# EAGLE design gtjennings_4 (EAGLE 7.6.0)
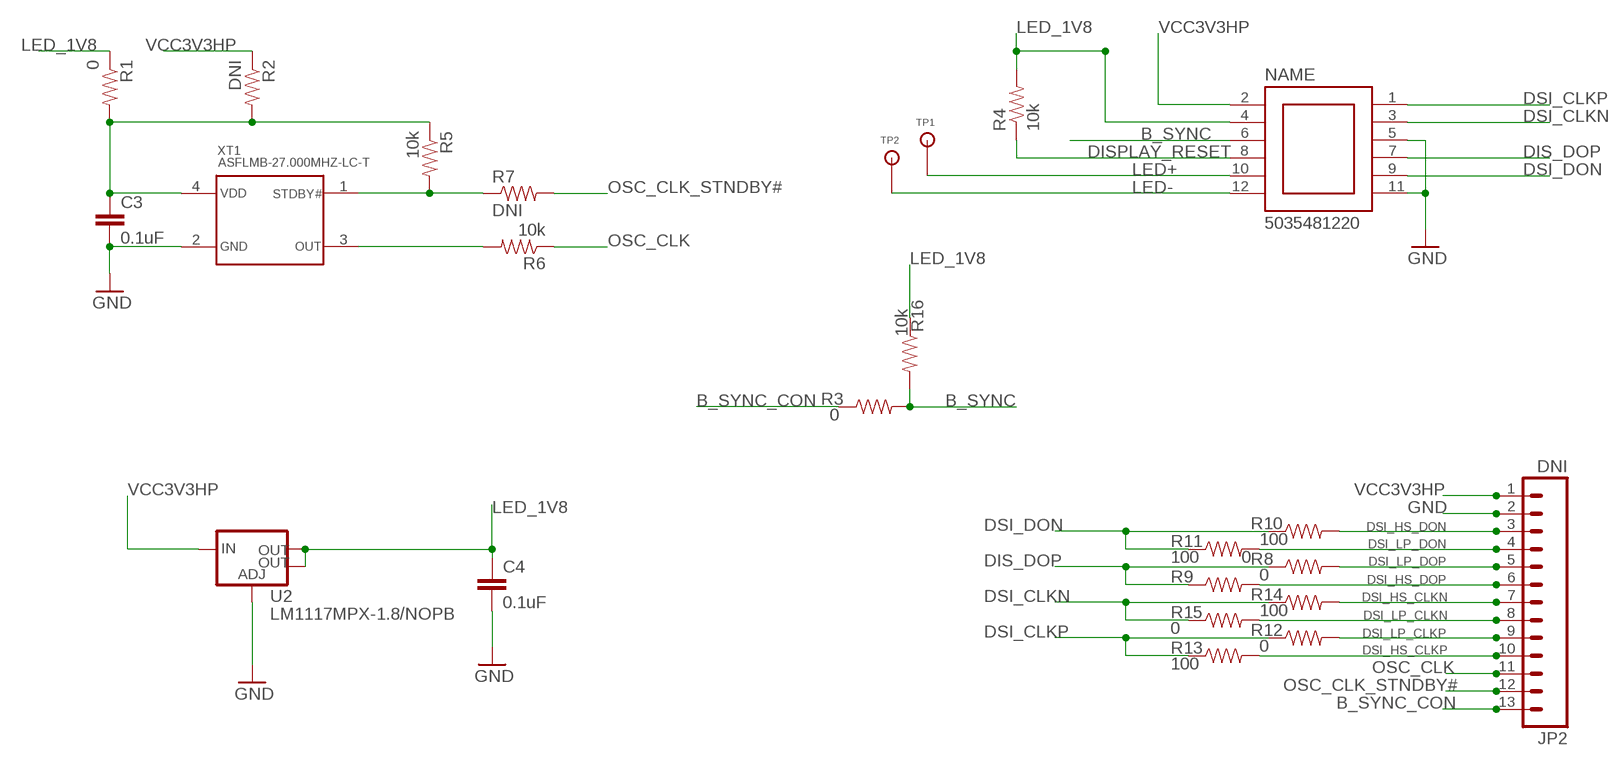
[diagram p0: schematic, sheet 1]

## Parts
C3  0.1uF  CAP0402-CAP  [0402-CAP]
C4  0.1uF  CAP0402-CAP  [0402-CAP]
JP1  5035481220  [5035481220]
JP2  DNI  M13  [1X13]
R1  0  RESISTOR0402  [0402-RES]
R2  DNI  RESISTOR0402  [0402-RES]
R3  0  RESISTOR0402  [0402-RES]
R4  10k  RESISTOR0402  [0402-RES]
R5  10k  RESISTOR0402  [0402-RES]
R6  10k  RESISTOR0402  [0402-RES]
R7  DNI  RESISTOR0402  [0402-RES]
R8  0  RESISTOR0402  [0402-RES]
R9  100  RESISTOR0402  [0402-RES]
R10  100  RESISTOR0402  [0402-RES]
R11  0  RESISTOR0402  [0402-RES]
R12  0  RESISTOR0402  [0402-RES]
R13  100  RESISTOR0402  [0402-RES]
R14  100  RESISTOR0402  [0402-RES]
R15  0  RESISTOR0402  [0402-RES]
R16  10k  RESISTOR0402  [0402-RES]
TP1  TP  [TP]
TP2  TP  [TP]
U2  LM1117MPX-1.8/NOPB  V_REG_LM1117SOT223  [SOT223]
XT1  ASFLMB-27.000MHZ-LC-T  [ASFLMB-27.000MHZ-LC-T]

## Nets
B_SYNC: JP1.6 R3.2 R16.2
B_SYNC_CON: JP2.13 R3.1
DIS_DOP: JP1.7 R8.1 R9.1
DISPLAY_RESET: JP1.8 R4.1
DSI_CLKN: JP1.3 R14.1 R15.1
DSI_CLKP: JP1.1 R12.1 R13.1
DSI_DON: JP1.9 R10.1 R11.1
DSI_HS_CLKN: JP2.7 R14.2
DSI_HS_CLKP: JP2.10 R13.2
DSI_HS_DON: JP2.3 R10.2
DSI_HS_DOP: JP2.6 R9.2
DSI_LP_CLKN: JP2.8 R15.2
DSI_LP_CLKP: JP2.9 R12.2
DSI_LP_DON: JP2.4 R11.2
DSI_LP_DOP: JP2.5 R8.2
GND: C3.2 C4.2 JP1.5 JP1.11 JP2.2 U2.1(ADJ) XT1.2
LED+: JP1.10 TP1.1
LED-: JP1.12 TP2.1
LED_1V8: C4.1 JP1.4 R1.1 R4.2 R16.1 U2.2(OUT) U2.4(OUT)
N$1: R5.2 R7.1 XT1.1
OSC_CLK: JP2.11 R6.1
OSC_CLK6: R6.2 XT1.3
OSC_CLK_STNDBY#: JP2.12 R7.2
OSC_PWR: C3.1 R1.2 R2.2 R5.1 XT1.4
VCC3V3HP: JP1.2 JP2.1 R2.1 U2.3(IN)

## Library data of the parts
C3 C4 = SparkFun-Capacitors:CAP: Capacitor Standard 0603 ceramic capacitor, and 0.1" leaded capacitor.
JP1 = CONN-5035481220:5035481220
JP2 = SparkFun-Connectors:M13: 13-pin single row .1" header
R1-R16 = SparkFun-Resistors:RESISTOR: Resistor Basic schematic elements and footprints for 0603, 1206, and PTH resistors.
TP1 TP2 = TP:TP
U2 = SparkFun-PowerIC:V_REG_LM1117: Voltage Regulator LM1117 Standard adjustable voltage regulator but in SMD form. Spark Fun Electronics SKU : COM-00595; PROD_ID: VREG-08170
XT1 = ASFLMB-27.000MHZ-LC-T:ASFLMB-27.000MHZ-LC-T

## Net classes
0 default: width 0.152 mm

## Board
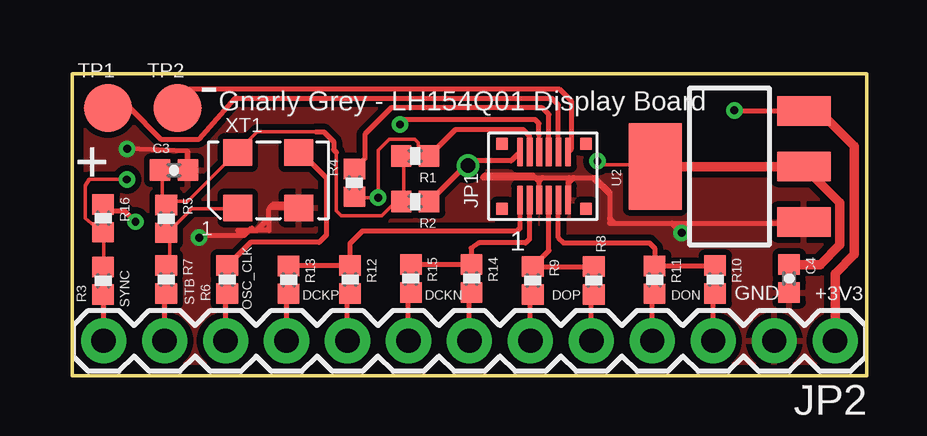
[diagram p1: board, top side]
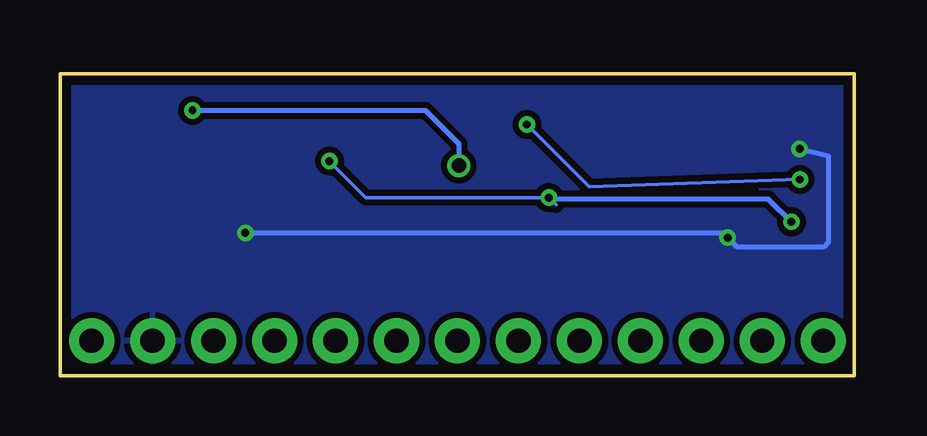
[diagram p2: board, bottom side, seen from below]

Size 33.1 x 12.58 mm. Coordinates in mm from the lower left corner, seen from the top.
Outline: 33.1,0 33.1,12.58 0,12.58 0,0 33.1,0
Copper layers (1*16): Top 0.0356mm / dielectric 1.5011mm / Bottom 0.0356mm
Design rules "default": minimum track width 6mil, minimum drill 13mil, track to track 6mil, track to pad 6mil, pad to pad 6mil, via to via 6mil, smd to smd 6mil, copper to edge 15mil, drill to drill 6mil, minimum pad ring 7mil, minimum via ring 7mil, stop-mask expansion 3mil, vias tented up to drill 0mil, thermal gap 10mil

### Footprints (pad centres in the part's own frame; a part is rotated, then mirrored left to right if it is on the bottom)
0402-CAP = smd 0.85 x 0.9: 1 -0.58,0; 2 0.58,0
5035481220 = smd 0.24 x 1.18: 1 -1,-1; 2 -1,1; 3 -0.6,-1; 4 -0.6,1; 5 -0.2,-1; 6 -0.2,1; 7 0.2,-1; 8 0.2,1; 9 0.6,-1; 10 0.6,1; 11 1,-1; 12 1,1 | smd 0.47 x 0.5: P$1 -1.75,1.35; P$2 1.75,1.35; P$3 -1.75,-1.35; P$4 1.75,-1.35
1X13 = drill 1.016 pad 1.88: 1 0,0; 2 2.54,0; 3 5.08,0; 4 7.62,0; 5 10.16,0; 6 12.7,0; 7 15.24,0; 8 17.78,0; 9 20.32,0; 10 22.86,0; 11 25.4,0; 12 27.94,0; 13 30.48,0
0402-RES = smd 0.85 x 0.9: 1 -0.58,0; 2 0.58,0
TP = smd 2 x 2: 1 0,0
SOT223 = smd 1.219 x 2.235: 1 -2.311,-3.099; 2 0,-3.099; 3 2.311,-3.099 | smd 3.6 x 2.2: 4 0,3.099
ASFLMB-27.000MHZ-LC-T = smd 1.2 x 1.1: 1 -1.27,-1.15; 2 1.27,-1.15; 3 1.27,1.15; 4 -1.27,1.15

### Placement (x,y rotation side)
C3  4.23,8.56 0 top
C4  29.86,4.04 270 top
JP1  19.65,8.31 0 top
JP2  31.78,1.45 180 top
R1  14.28,9.15 180 top
R2  14.28,7.25 180 top
R3  1.28,3.95 90 top
R4  11.75,8.03 270 top
R5  3.91,6.53 270 top
R6  6.45,4 90 top
R7  3.91,4 270 top
R8  21.72,3.96 270 top
R9  19.18,3.96 270 top
R10  26.78,4 270 top
R11  24.26,3.99 270 top
R12  11.57,4 270 top
R13  9.01,3.99 270 top
R14  16.63,4.04 270 top
R15  14.1,4.04 270 top
R16  1.28,6.55 270 top
TP1  1.48,11.15 0 top
TP2  4.38,11.15 0 top
U2  27.38,8.71 90 top
XT1  8.16,8.14 0 top

### Tracks (layer width: path | path; a pad name or v marks a point on that pad's centre or on a via)
B_SYNC  (via drill 0.33)
  Top 0.152: R3.2 1.3,4.67 1.3,5.89 R16.2 1.15,6.04 0.54,6.55 0.54,7.92 0.69,8.17 v2.27,8.17 | 19.44,10 19.44,9.39 JP1.6
  Top 0.2: v13.65,10.46 13.85,10.66 19.28,10.66 19.44,10.5 19.44,10
  Bottom 0.152: v13.65,10.46 11.06,7.87 v2.27,8.17
B_SYNC_CON
  Top 0.2: JP2.13 1.3,3.35 R3.1
DIS_DOP
  Top 0.2: R8.1 R9.1 19.85,5.21 JP1.7
DISPLAY_RESET
  Top 0.2: JP1.8 19.85,10.88 19.58,11.15 13.28,11.15 12.18,10.05 12.18,9.04 R4.1
DSI_CLKN
  Top 0.2: R15.1 R14.1 16.61,4.64 16.61,5.31 16.93,5.53 18.88,5.53 19.05,5.7 JP1.3
DSI_CLKP
  Top 0.2: R13.1 R12.1 11.56,5.5 12.08,6.02 18.52,6.02 18.65,6.15 JP1.1
DSI_DON
  Top 0.2: R10.1 R11.1 24.26,5.31 24.04,5.53 20.47,5.53 20.25,5.75 JP1.9
DSI_HS_CLKN
  Top 0.2: JP2.7 16.54,3.37 R14.2
DSI_HS_CLKP
  Top 0.2: JP2.10 8.92,3.32 R13.2
DSI_HS_DON
  Top 0.2: JP2.3 26.7,3.34 R10.2
DSI_HS_DOP
  Top 0.2: JP2.6 19.08,3.28 R9.2
DSI_LP_CLKN
  Top 0.2: JP2.8 14,3.36 R15.2
DSI_LP_CLKP
  Top 0.2: JP2.9 11.46,3.31 R12.2
DSI_LP_DON
  Top 0.2: JP2.4 24.16,3.31 R11.2
DSI_LP_DOP
  Top 0.2: JP2.5 21.62,3.28 R8.2
GND  (via drill 0.33)
  Top 0.152: 29.34,1.47 JP2.2
  Top 0.2: 30.48,6.35 30.48,6.45 30.38,6.35 22.58,6.35 22.38,6.55 22.38,7.55 21.68,8.25 20.88,8.25 20.65,8.02 JP1.11 20.68,7.34 20.68,8.25 19.58,8.25 19.45,8.12 JP1.5 19.45,8.08 19.18,8.35 17.18,8.35 17.08,8.25 21.78,8.25 22.38,7.65 22.38,6.35 24.98,6.35 v25.38,5.95 | v5.28,5.75 5.38,5.85 7.18,5.85 7.48,6.15 | XT1.2 8.22,6.99 | 8.22,6.99 8.18,6.95 8.18,6.55 | 8.18,6.55 8.18,6.05 7.68,6.05 | 6.88,6.05 7.68,6.05 | 7.68,6.05 8.18,6.55 | 8.22,6.99 8.38,7.15 9.18,7.15 9.38,6.95 | C3.2 4.81,9.32 4.78,9.35 v2.28,9.45
  Bottom 0.2: v25.38,5.95 5.48,5.95 v5.28,5.75 4.88,5.35 1.28,5.35 1.08,5.55 1.08,9.15 v2.28,9.45
  pour Top (isolate 0.254): 0.1,12.47 33.2,12.47 33.2,-0.03 0.1,-0.03
  pour Bottom (isolate 0.254): 0.1,12.47 33.1,12.47 33.1,-0.03 0.1,-0.03
LED+
  Top 0.2: TP1.1 2.38,11.15 3.68,9.85 5.28,9.85 6.78,11.55 19.98,11.55 20.25,11.28 JP1.10
LED-
  Top 0.2: TP2.1 4.38,11.65 4.68,11.95 20.28,11.95 20.78,11.45 20.78,9.44 JP1.12
LED_1V8  (via drill 0.33)
  Top 0.152: 1.3,7.11 R16.1 | R4.2 11.82,7.41 v12.73,7.41 12.73,9.39 13.19,9.85 14.26,9.85 14.41,9.7 14.41,9.55 14.71,9.24 R1.1 | v21.88,8.94 22.03,8.79 24.16,8.79 U2.4
  Top 0.2: JP1.4 19.05,9.98 18.78,10.25 15.96,10.25 R1.1 | v2.63,6.41 2.53,6.5 2.18,6.85 1.56,6.85 R16.1
  Top 0.4: C4.1 31.15,4.62 31.98,5.45 31.98,7.21 U2.2 U2.4
  Bottom 0.152: 12.43,7.11 v12.73,7.41 20.35,7.41 v21.88,8.94
  Bottom 0.2: v2.63,6.41 2.53,6.3 3.58,7.35 12.67,7.35 v12.73,7.41
N$1
  Top 0.152: R7.1 4.05,4.67 4.05,5.89 R5.2 4.05,6.04 4.96,6.96 6.79,6.96 XT1.1
OSC_CLK
  Top 0.2: JP2.11 6.38,3.35 R6.1
OSC_CLK6
  Top 0.2: XT1.3 9.54,9.29 10.58,8.25 10.58,5.85 10.28,5.55 7.42,5.55 R6.2
OSC_CLK_STNDBY#
  Top 0.2: JP2.12 3.84,3.35 R7.2
OSC_PWR
  Top 0.152: R1.2 13.8,9.09 13.8,7.26 R2.2 13.65,7.11 13.34,7.11 12.89,6.65 11.21,6.65 10.99,6.87 10.99,9.3 | 10.14,10.16 7.7,10.16 6.94,9.39 XT1.4 6.79,9.24 4.81,7.26 4.05,7.26 R5.1 3.89,7.26 3.74,7.41 3.74,8.48 C3.1
  Top 0.2: 10.14,10.16 10.47,10.16 10.88,9.75 10.88,9.42 10.99,9.3
VCC3V3HP  (via drill 0.33, 0.6)
  Top 0.2: U2.3 27.61,11.02 v27.58,11.05 | R2.1 16.36,8.75 v16.48,8.75 16.68,8.95 18.28,8.95 18.55,9.22 18.65,9.22 JP1.2
  Top 0.4: JP2.1 31.78,4.25 32.58,5.05 32.58,9.55 31.38,10.75 30.75,10.75 U2.3
  Bottom 0.2: v27.58,11.05 17.88,11.05 16.48,9.65 v16.48,8.75

### Text on the board
tPlace: - | Gnarly Grey - LH154Q01 Display Board | + | SYNC | STB | OSC_CLK | DCKP | DCKN | DOP | DON | GND | +3V3